# EAGLE schematic poseidon (EAGLE 9.2.2)

## Sheet 1 of 3
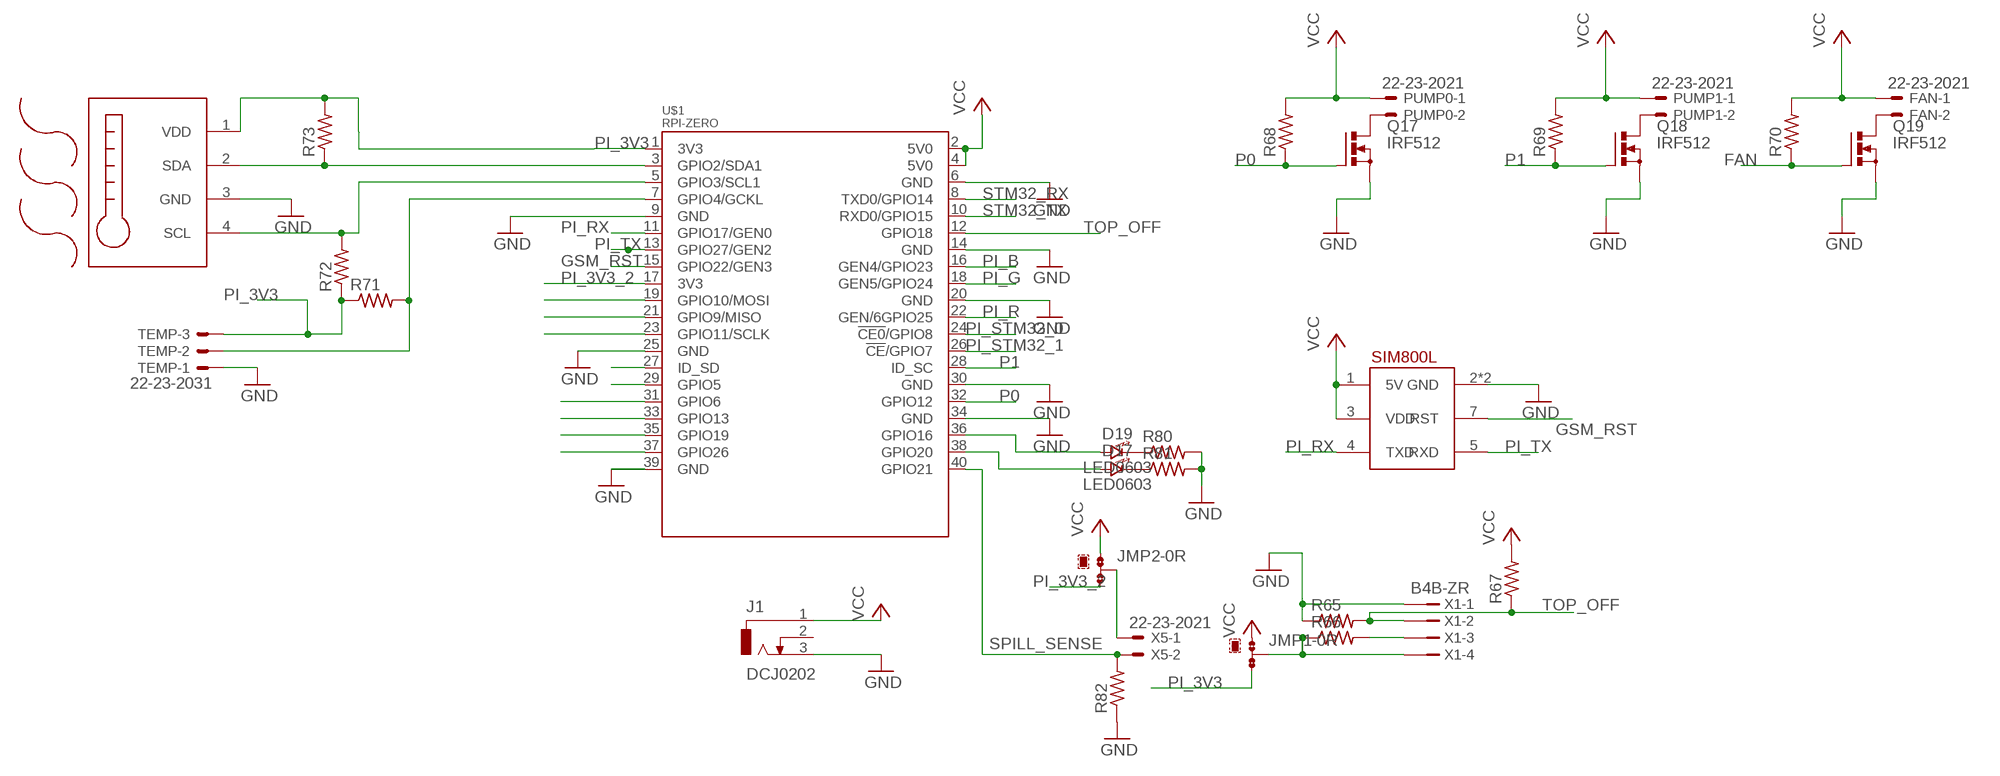
[diagram p0: schematic, sheet 1]

### Parts
D17  LED0603  [LED-0603]
D19  LED0603  [LED-0603]
FAN  22-23-2021  [22-23-2021]
J1  DCJ0202  [DCJ0202]
JMP1  0R-JUMPA  [A0R-JMP]
JMP2  0R-JUMPA  [A0R-JMP]
PUMP0  22-23-2021  [22-23-2021]
PUMP1  22-23-2021  [22-23-2021]
Q17  IRF512  [TO220BV]
Q18  IRF512  [TO220BV]
Q19  IRF512  [TO220BV]
R65  R-US_R0805  [R0805]
R66  R-US_R0805  [R0805]
R67  R-US_M0805  [M0805]
R68  R-US_R0805  [R0805]
R69  R-US_R0805  [R0805]
R70  R-US_R0805  [R0805]
R71  R-US_R0805  [R0805]
R72  R-US_R0805  [R0805]
R73  R-US_R0805  [R0805]
R80  R-US_R0805  [R0805]
R81  R-US_R0805  [R0805]
R82  R-US_R0805  [R0805]
TEMP  22-23-2031  [22-23-2031]
U$1  RPI-ZERO  [RASPBERRYPI_BASTELSTUBE_V13_RASPI_BOARD_B+_FULL]
U$3  AM2320  [4PIN_SMD]
U$21  SIM800L  [SIP]
X1  B4B-ZR  [B4B-ZR]
X5  22-23-2021  [22-23-2021]

### Nets
FAN: Q19.G R70.1 ; also sheet 3
GND: J1.3 Q17.S Q18.S Q19.S R65.1 R80.2 R81.2 R82.1 TEMP.1 U$1.6(GND) U$1.9(GND) U$1.14(GND) U$1.20(GND) U$1.25(GND) U$1.30(GND) U$1.34(GND) U$1.39(GND) U$3.3(GND) U$21.2(GND) U$21.6(GND) X1.1 ; also sheet 2,3
GSM_RST: U$1.15(GPIO22/GEN3) U$21.7(RST)
N$1: PUMP0.2 Q17.D
N$5: D19.C(CATHODE) R80.1
N$6: R66.2 X1.3
N$9: JMP1.2 R66.1 X1.4
N$10: PUMP1.2 Q18.D
N$13: D17.C(CATHODE) R81.1
N$14: FAN.2 Q19.D
N$17: R71.2 TEMP.2 U$1.7(GPIO4/GCKL)
N$18: R73.1 U$1.3(GPIO2/SDA1) U$3.2(SDA)
N$21: R72.2 U$1.5(GPIO3/SCL1) U$3.4(SCL)
N$26: D19.A(ANODE) U$1.36(GPIO16)
N$29: D17.A(ANODE) U$1.38(GPIO20)
N$30: JMP2.2 X5.1
N$33: U$1.19(GPIO10/MOSI)
N$37: U$1.21(GPIO9/MISO)
N$38: U$1.23(GPIO11/SCLK)
N$41: U$1.27(ID_SD)
N$42: U$1.29(GPIO5)
N$45: U$1.31(GPIO6)
N$46: U$1.33(GPIO13)
N$49: U$1.35(GPIO19)
N$50: U$1.37(GPIO26)
P0: Q17.G R68.1 U$1.32(GPIO12)
P1: Q18.G R69.1 U$1.28(ID_SC)
PI_3V3: JMP1.3 R71.1 R72.1 R73.2 TEMP.3 U$1.1(3V3) U$3.1(VDD) ; also sheet 3
PI_3V3_2: JMP2.3 U$1.17(3V3)
PI_B: U$1.16(GEN4/GPIO23) ; also sheet 3
PI_G: U$1.18(GEN5/GPIO24) ; also sheet 3
PI_R: U$1.22(GEN/6GPIO25) ; also sheet 3
PI_RX: U$1.11(GPIO17/GEN0) U$21.4(TXD)
PI_STM32_0: U$1.24(!CE0!/GPIO8) ; also sheet 3
PI_STM32_1: U$1.26(!CE!/GPIO7) ; also sheet 3
PI_TX: U$1.13(GPIO27/GEN2) U$21.5(RXD)
SPILL_SENSE: R82.2 U$1.40(GPIO21) X5.2
STM32_RX: U$1.8(TXD0/GPIO14) ; also sheet 3
STM32_TX: U$1.10(RXD0/GPIO15) ; also sheet 3
TOP_OFF: R65.2 R67.1 U$1.12(GPIO18) X1.2
VCC: FAN.1 J1.1 JMP1.1 JMP2.1 PUMP0.1 PUMP1.1 R67.2 R68.2 R69.2 R70.2 U$1.2(5V0) U$1.4(5V0) U$21.1(5V) U$21.3(VDD) ; also sheet 2,3
Unconnected: J1.2

## Sheet 2 of 3
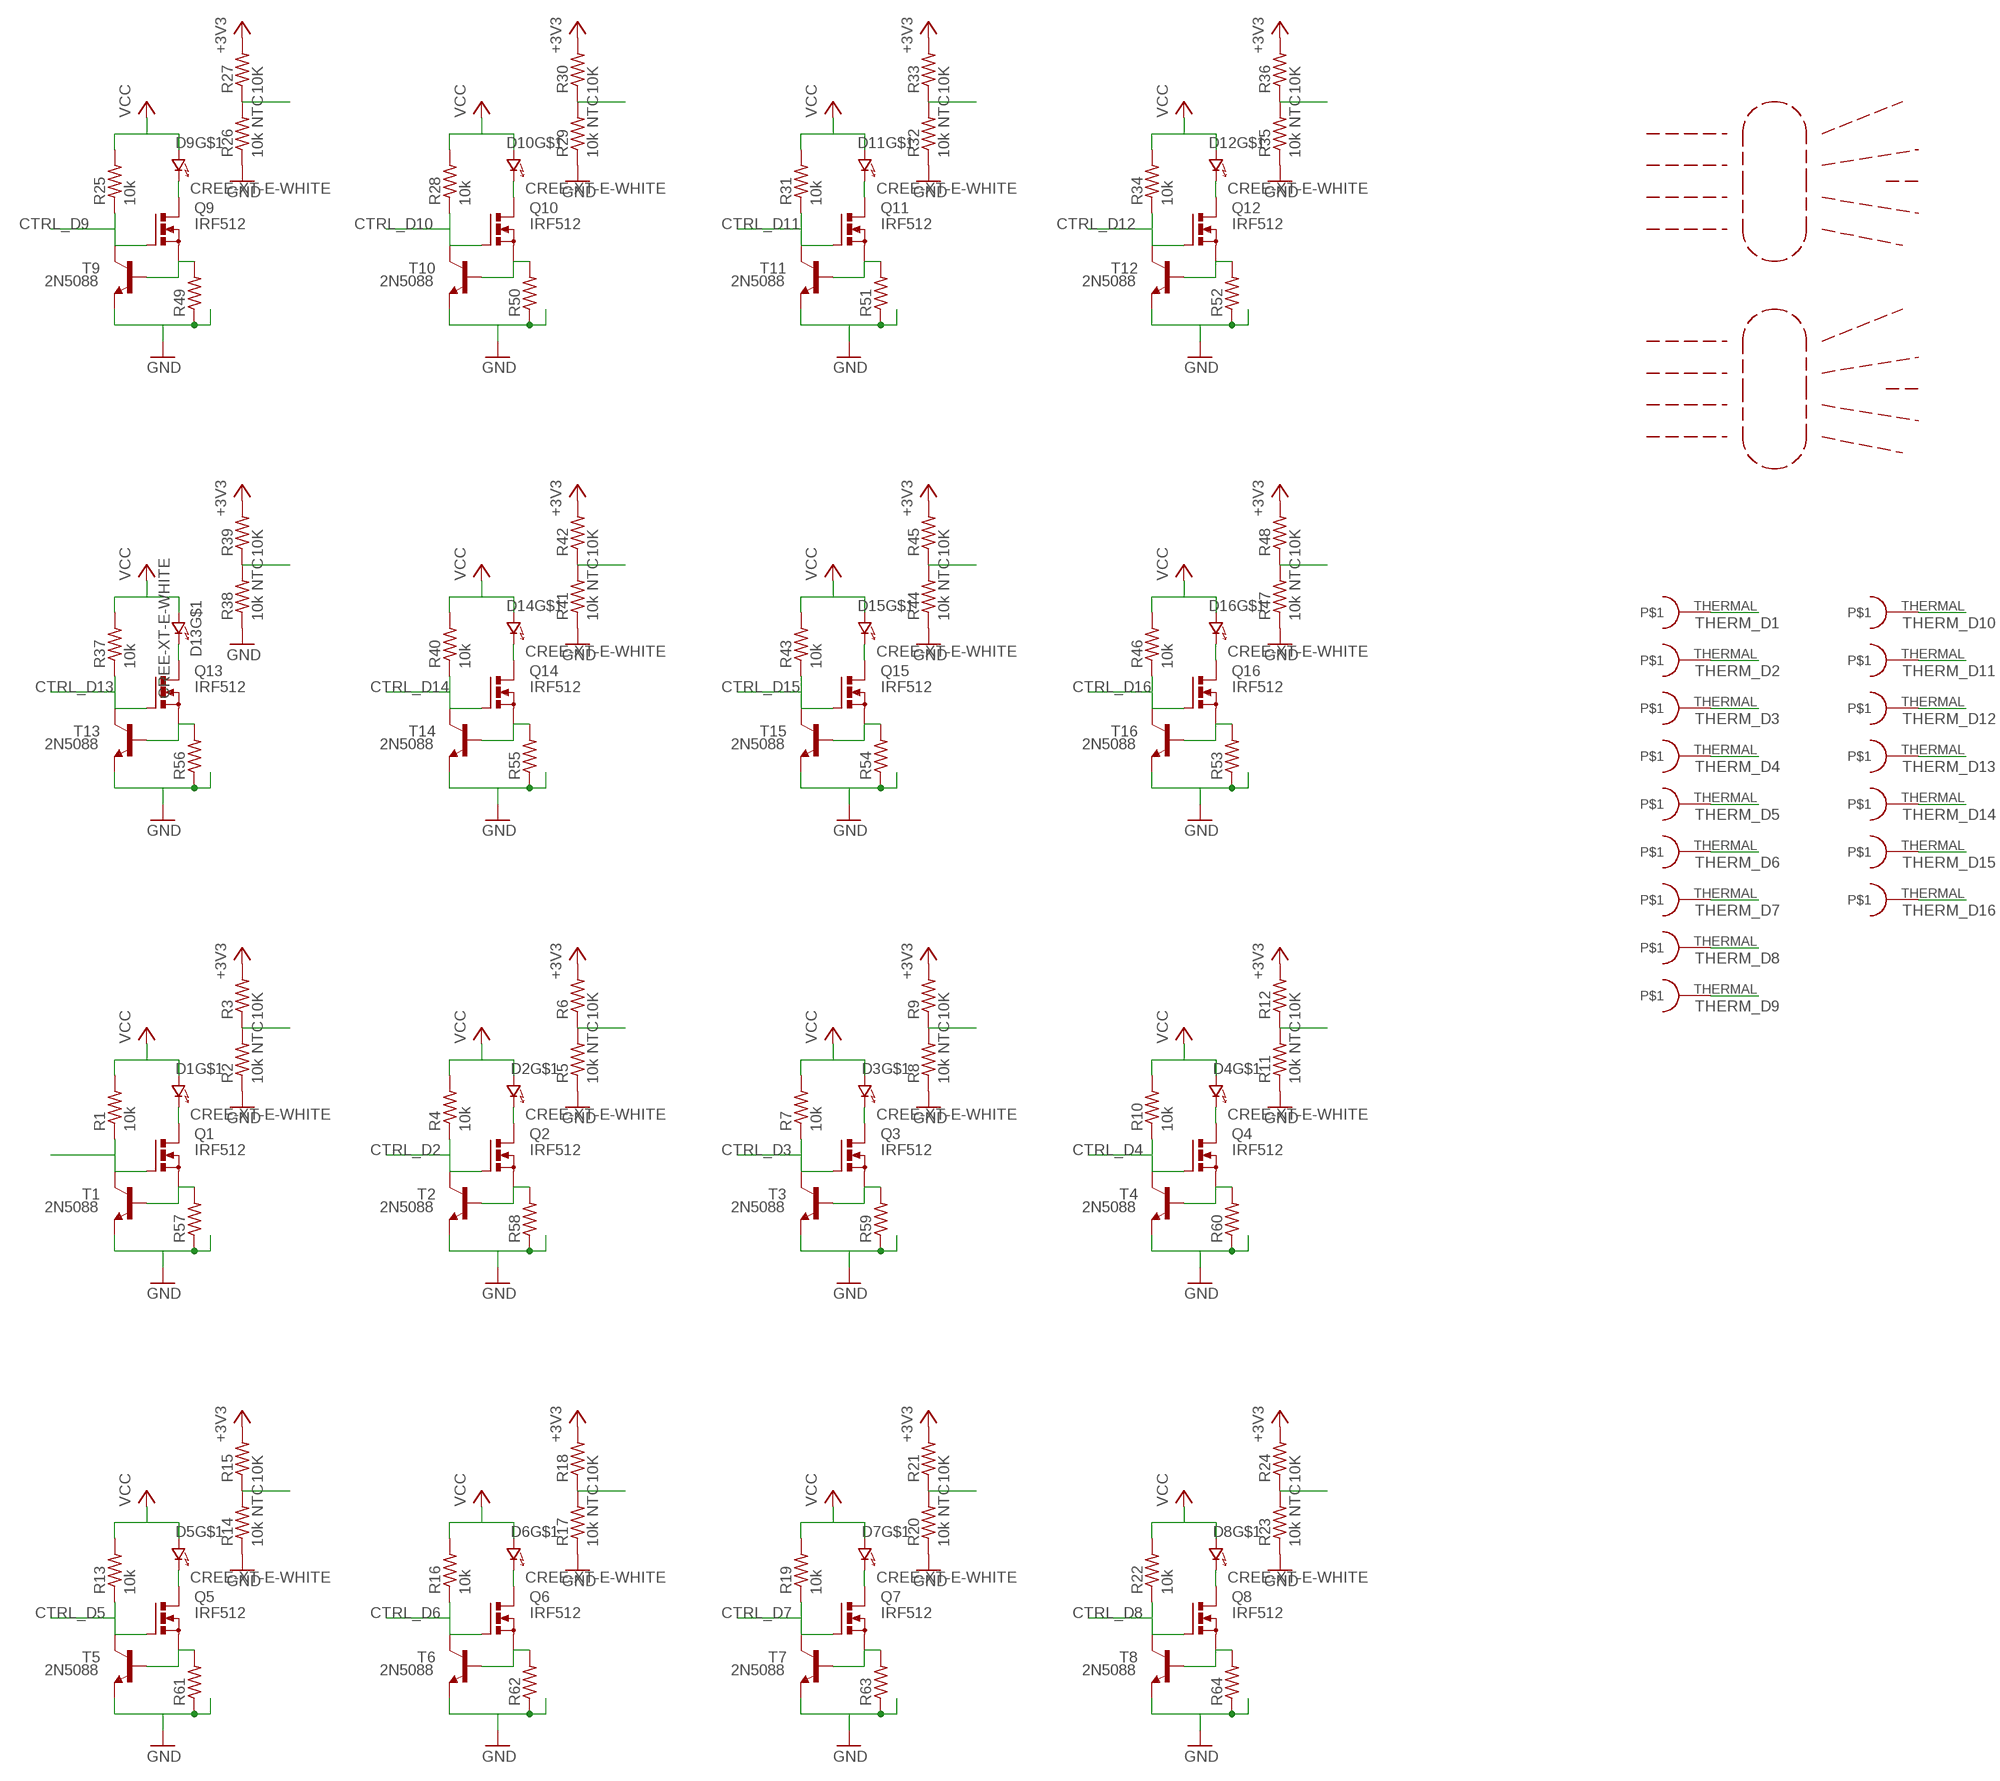
[diagram p1: schematic, sheet 2]

### Parts
D1  CREE-XT-E-WHITE  [CREE-XT-E]
D2  CREE-XT-E-WHITE  [CREE-XT-E]
D3  CREE-XT-E-WHITE  [CREE-XT-E]
D4  CREE-XT-E-WHITE  [CREE-XT-E]
D5  CREE-XT-E-WHITE  [CREE-XT-E]
D6  CREE-XT-E-WHITE  [CREE-XT-E]
D7  CREE-XT-E-WHITE  [CREE-XT-E]
D8  CREE-XT-E-WHITE  [CREE-XT-E]
D9  CREE-XT-E-WHITE  [CREE-XT-E]
D10  CREE-XT-E-WHITE  [CREE-XT-E]
D11  CREE-XT-E-WHITE  [CREE-XT-E]
D12  CREE-XT-E-WHITE  [CREE-XT-E]
D13  CREE-XT-E-WHITE  [CREE-XT-E]
D14  CREE-XT-E-WHITE  [CREE-XT-E]
D15  CREE-XT-E-WHITE  [CREE-XT-E]
D16  CREE-XT-E-WHITE  [CREE-XT-E]
Q1  IRF512  [TO220BV]
Q2  IRF512  [TO220BV]
Q3  IRF512  [TO220BV]
Q4  IRF512  [TO220BV]
Q5  IRF512  [TO220BV]
Q6  IRF512  [TO220BV]
Q7  IRF512  [TO220BV]
Q8  IRF512  [TO220BV]
Q9  IRF512  [TO220BV]
Q10  IRF512  [TO220BV]
Q11  IRF512  [TO220BV]
Q12  IRF512  [TO220BV]
Q13  IRF512  [TO220BV]
Q14  IRF512  [TO220BV]
Q15  IRF512  [TO220BV]
Q16  IRF512  [TO220BV]
R1  10k  R-US_R0805  [R0805]
R2  10k NTC  R-US_R0805  [R0805]
R3  10K  R-US_R0603  [R0603]
R4  10k  R-US_R0805  [R0805]
R5  10k NTC  R-US_R0805  [R0805]
R6  10K  R-US_R0603  [R0603]
R7  10k  R-US_R0805  [R0805]
R8  10k NTC  R-US_R0805  [R0805]
R9  10K  R-US_R0603  [R0603]
R10  10k  R-US_R0805  [R0805]
R11  10k NTC  R-US_R0805  [R0805]
R12  10K  R-US_R0603  [R0603]
R13  10k  R-US_R0805  [R0805]
R14  10k NTC  R-US_R0805  [R0805]
R15  10K  R-US_R0603  [R0603]
R16  10k  R-US_R0805  [R0805]
R17  10k NTC  R-US_R0805  [R0805]
R18  10K  R-US_R0603  [R0603]
R19  10k  R-US_R0805  [R0805]
R20  10k NTC  R-US_R0805  [R0805]
R21  10K  R-US_R0603  [R0603]
R22  10k  R-US_R0805  [R0805]
R23  10k NTC  R-US_R0805  [R0805]
R24  10K  R-US_R0603  [R0603]
R25  10k  R-US_R0805  [R0805]
R26  10k NTC  R-US_R0805  [R0805]
R27  10K  R-US_R0603  [R0603]
R28  10k  R-US_R0805  [R0805]
R29  10k NTC  R-US_R0805  [R0805]
R30  10K  R-US_R0603  [R0603]
R31  10k  R-US_R0805  [R0805]
R32  10k NTC  R-US_R0805  [R0805]
R33  10K  R-US_R0603  [R0603]
R34  10k  R-US_R0805  [R0805]
R35  10k NTC  R-US_R0805  [R0805]
R36  10K  R-US_R0603  [R0603]
R37  10k  R-US_R0805  [R0805]
R38  10k NTC  R-US_R0805  [R0805]
R39  10K  R-US_R0603  [R0603]
R40  10k  R-US_R0805  [R0805]
R41  10k NTC  R-US_R0805  [R0805]
R42  10K  R-US_R0603  [R0603]
R43  10k  R-US_R0805  [R0805]
R44  10k NTC  R-US_R0805  [R0805]
R45  10K  R-US_R0603  [R0603]
R46  10k  R-US_R0805  [R0805]
R47  10k NTC  R-US_R0805  [R0805]
R48  10K  R-US_R0603  [R0603]
R49  R-US_R2512  [R2512]
R50  R-US_R2512  [R2512]
R51  R-US_R2512  [R2512]
R52  R-US_R2512  [R2512]
R53  R-US_R2512  [R2512]
R54  R-US_R2512  [R2512]
R55  R-US_R2512  [R2512]
R56  R-US_R2512  [R2512]
R57  R-US_R2512  [R2512]
R58  R-US_R2512  [R2512]
R59  R-US_R2512  [R2512]
R60  R-US_R2512  [R2512]
R61  R-US_R2512  [R2512]
R62  R-US_R2512  [R2512]
R63  R-US_R2512  [R2512]
R64  R-US_R2512  [R2512]
T1  2N5088  [TO92]
T2  2N5088  [TO92]
T3  2N5088  [TO92]
T4  2N5088  [TO92]
T5  2N5088  [TO92]
T6  2N5088  [TO92]
T7  2N5088  [TO92]
T8  2N5088  [TO92]
T9  2N5088  [TO92]
T10  2N5088  [TO92]
T11  2N5088  [TO92]
T12  2N5088  [TO92]
T13  2N5088  [TO92]
T14  2N5088  [TO92]
T15  2N5088  [TO92]
T16  2N5088  [TO92]
U$19  8X_LED_OPTIC  [FOCUS_GRID]
U$20  8X_LED_OPTIC  [FOCUS_GRID]

### Nets
+3V3: R3.2 R6.2 R9.2 R12.2 R15.2 R18.2 R21.2 R24.2 R27.2 R30.2 R33.2 R36.2 R39.2 R42.2 R45.2 R48.2 ; also sheet 3
CTRL_D1: Q1.G R1.1 T1.1(C) ; also sheet 3
CTRL_D2: Q2.G R4.1 T2.1(C) ; also sheet 3
CTRL_D3: Q3.G R7.1 T3.1(C) ; also sheet 3
CTRL_D4: Q4.G R10.1 T4.1(C) ; also sheet 3
CTRL_D5: Q5.G R13.1 T5.1(C) ; also sheet 3
CTRL_D6: Q6.G R16.1 T6.1(C) ; also sheet 3
CTRL_D7: Q7.G R19.1 T7.1(C) ; also sheet 3
CTRL_D8: Q8.G R22.1 T8.1(C) ; also sheet 3
CTRL_D9: Q9.G R25.1 T9.1(C) ; also sheet 3
CTRL_D10: Q10.G R28.1 T10.1(C) ; also sheet 3
CTRL_D11: Q11.G R31.1 T11.1(C) ; also sheet 3
CTRL_D12: Q12.G R34.1 T12.1(C) ; also sheet 3
CTRL_D13: Q13.G R37.1 T13.1(C) ; also sheet 3
CTRL_D14: Q14.G R40.1 T14.1(C) ; also sheet 3
CTRL_D15: Q15.G R43.1 T15.1(C) ; also sheet 3
CTRL_D16: Q16.G R46.1 T16.1(C) ; also sheet 3
GND: R2.1 R5.1 R8.1 R11.1 R14.1 R17.1 R20.1 R23.1 R26.1 R29.1 R32.1 R35.1 R38.1 R41.1 R44.1 R47.1 R49.1 R50.1 R51.1 R52.1 R53.1 R54.1 R55.1 R56.1 R57.1 R58.1 R59.1 R60.1 R61.1 R62.1 R63.1 R64.1 T1.3(E) T2.3(E) T3.3(E) T4.3(E) T5.3(E) T6.3(E) T7.3(E) T8.3(E) T9.3(E) T10.3(E) T11.3(E) T12.3(E) T13.3(E) T14.3(E) T15.3(E) T16.3(E) ; also sheet 1,3
N$2: D1.K(CATHODE) Q1.D
N$4: Q1.S R57.2 T1.2(B)
N$7: D2.K(CATHODE) Q2.D
N$8: Q2.S R58.2 T2.2(B)
N$11: D3.K(CATHODE) Q3.D
N$12: Q3.S R59.2 T3.2(B)
N$15: D4.K(CATHODE) Q4.D
N$16: Q4.S R60.2 T4.2(B)
N$19: D5.K(CATHODE) Q5.D
N$20: Q5.S R61.2 T5.2(B)
N$23: D6.K(CATHODE) Q6.D
N$24: Q6.S R62.2 T6.2(B)
N$27: D7.K(CATHODE) Q7.D
N$28: Q7.S R63.2 T7.2(B)
N$31: D8.K(CATHODE) Q8.D
N$32: Q8.S R64.2 T8.2(B)
N$35: D9.K(CATHODE) Q9.D
N$36: Q9.S R49.2 T9.2(B)
N$39: D10.K(CATHODE) Q10.D
N$40: Q10.S R50.2 T10.2(B)
N$43: D11.K(CATHODE) Q11.D
N$44: Q11.S R51.2 T11.2(B)
N$47: D12.K(CATHODE) Q12.D
N$48: Q12.S R52.2 T12.2(B)
N$51: D13.K(CATHODE) Q13.D
N$52: Q13.S R56.2 T13.2(B)
N$55: D14.K(CATHODE) Q14.D
N$56: Q14.S R55.2 T14.2(B)
N$59: D15.K(CATHODE) Q15.D
N$60: Q15.S R54.2 T15.2(B)
N$63: D16.K(CATHODE) Q16.D
N$64: Q16.S R53.2 T16.2(B)
TEMP_D1: R41.2 R42.1 ; also sheet 3
TEMP_D2: R8.2 R9.1 ; also sheet 3
TEMP_D3: R14.2 R15.1 ; also sheet 3
TEMP_D4: R17.2 R18.1 ; also sheet 3
TEMP_D5: R44.2 R45.1 ; also sheet 3
TEMP_D6: R47.2 R48.1 ; also sheet 3
TEMP_D7: R11.2 R12.1 ; also sheet 3
TEMP_D8: R20.2 R21.1 ; also sheet 3
TEMP_D9: R32.2 R33.1 ; also sheet 3
TEMP_D10: R29.2 R30.1 ; also sheet 3
TEMP_D11: R26.2 R27.1 ; also sheet 3
TEMP_D12: R23.2 R24.1 ; also sheet 3
TEMP_D13: R5.2 R6.1 ; also sheet 3
TEMP_D14: R35.2 R36.1 ; also sheet 3
TEMP_D15: R38.2 R39.1 ; also sheet 3
TEMP_D16: R2.2 R3.1 ; also sheet 3
THERM_D1: D1.THERMAL
THERM_D2: D2.THERMAL
THERM_D3: D3.THERMAL
THERM_D4: D4.THERMAL
THERM_D5: D5.THERMAL
THERM_D6: D6.THERMAL
THERM_D7: D7.THERMAL
THERM_D8: D8.THERMAL
THERM_D9: D9.THERMAL
THERM_D10: D10.THERMAL
THERM_D11: D11.THERMAL
THERM_D12: D12.THERMAL
THERM_D13: D13.THERMAL
THERM_D14: D14.THERMAL
THERM_D15: D15.THERMAL
THERM_D16: D16.THERMAL
VCC: D1.A(ANODE) D2.A(ANODE) D3.A(ANODE) D4.A(ANODE) D5.A(ANODE) D6.A(ANODE) D7.A(ANODE) D8.A(ANODE) D9.A(ANODE) D10.A(ANODE) D11.A(ANODE) D12.A(ANODE) D13.A(ANODE) D14.A(ANODE) D15.A(ANODE) D16.A(ANODE) R1.2 R4.2 R7.2 R10.2 R13.2 R16.2 R19.2 R22.2 R25.2 R28.2 R31.2 R34.2 R37.2 R40.2 R43.2 R46.2 ; also sheet 1,3

## Sheet 3 of 3
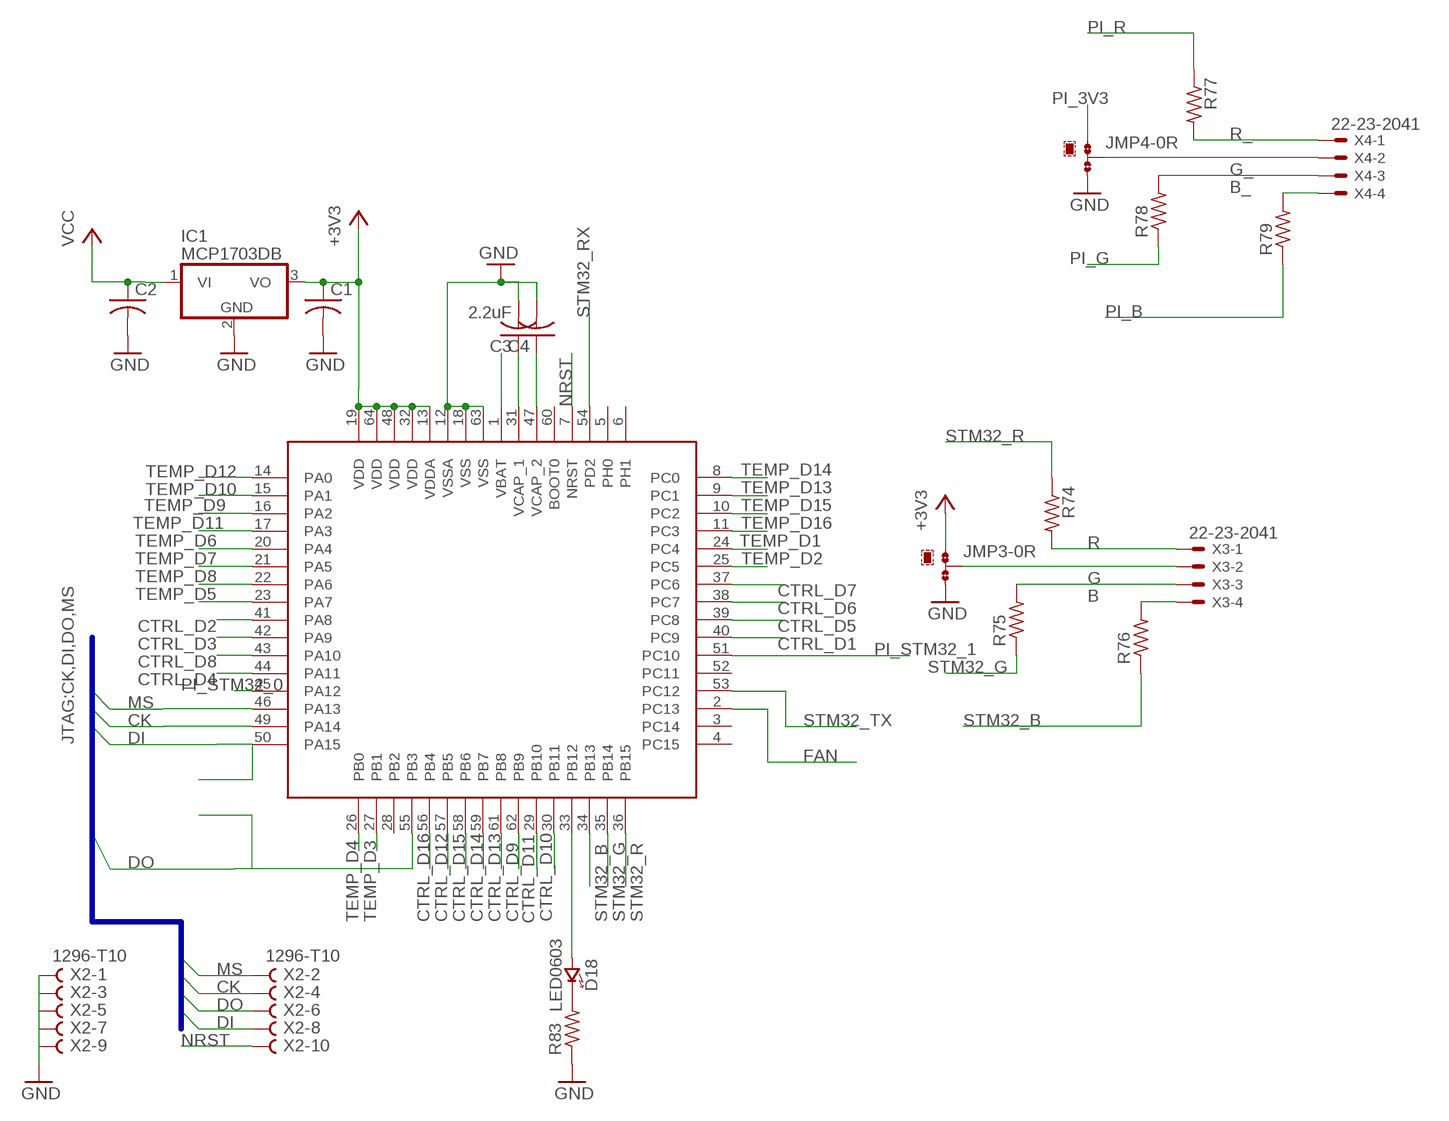
[diagram p2: schematic, sheet 3]

### Parts
C1  C-USC0805  [C0805]
C2  C-USC0805  [C0805]
C3  2.2uF  C-USC0402K  [C0402K]
C4  C-USC0402K  [C0402K]
D18  LED0603  [LED-0603]
IC1  MCP1703DB  [SOT223]
JMP3  0R-JUMPA  [A0R-JMP]
JMP4  0R-JUMPA  [A0R-JMP]
R74  R-US_R0805  [R0805]
R75  R-US_R0805  [R0805]
R76  R-US_R0805  [R0805]
R77  R-US_R0805  [R0805]
R78  R-US_R0805  [R0805]
R79  R-US_R0805  [R0805]
R83  R-US_R0805  [R0805]
U$2  STM32F41  [QFP50P1200X1200X160-64]
X2  1296-T10  [1296-10]
X3  22-23-2041  [22-23-2041]
X4  22-23-2041  [22-23-2041]

### Nets
+3V3: C1.1 IC1.3(VO) JMP3.1 U$2.13(VDDA) U$2.19(VDD) U$2.32(VDD) U$2.48(VDD) U$2.64(VDD) ; also sheet 2
B: R76.2 X3.4
B_: R79.2 X4.4
CK: U$2.49(PA14) X2.4
CTRL_D1: U$2.40(PC9) ; also sheet 2
CTRL_D2: U$2.41(PA8) ; also sheet 2
CTRL_D3: U$2.42(PA9) ; also sheet 2
CTRL_D4: U$2.44(PA11) ; also sheet 2
CTRL_D5: U$2.39(PC8) ; also sheet 2
CTRL_D6: U$2.38(PC7) ; also sheet 2
CTRL_D7: U$2.37(PC6) ; also sheet 2
CTRL_D8: U$2.43(PA10) ; also sheet 2
CTRL_D9: U$2.62(PB9) ; also sheet 2
CTRL_D10: U$2.30(PB11) ; also sheet 2
CTRL_D11: U$2.29(PB10) ; also sheet 2
CTRL_D12: U$2.57(PB5) ; also sheet 2
CTRL_D13: U$2.61(PB8) ; also sheet 2
CTRL_D14: U$2.59(PB7) ; also sheet 2
CTRL_D15: U$2.58(PB6) ; also sheet 2
CTRL_D16: U$2.56(PB4) ; also sheet 2
DI: U$2.50(PA15) X2.8
DO: U$2.55(PB3) X2.6
FAN: U$2.2(PC13) ; also sheet 1
G: R75.2 X3.3
G_: R78.2 X4.3
GND: C1.2 C2.2 C3.2 C4.2 IC1.2(GND) JMP3.3 JMP4.3 R83.1 U$2.12(VSSA) U$2.18(VSS) U$2.63(VSS) X2.1 X2.3 X2.5 X2.7 X2.9 ; also sheet 1,2
MS: U$2.46(PA13) X2.2
N$3: U$2.1(VBAT)
N$22: JMP4.2 X4.2
N$25: JMP3.2 X3.2
N$68: D18.C(CATHODE) R83.2
N$69: D18.A(ANODE) U$2.33(PB12)
N$70: C3.1 U$2.31(VCAP_1)
N$71: C4.1 U$2.47(VCAP_2)
NRST: U$2.7(NRST) X2.10
PI_3V3: JMP4.1 ; also sheet 1
PI_B: R79.1 ; also sheet 1
PI_G: R78.1 ; also sheet 1
PI_R: R77.1 ; also sheet 1
PI_STM32_0: U$2.45(PA12) ; also sheet 1
PI_STM32_1: U$2.51(PC10) ; also sheet 1
R: R74.2 X3.1
R_: R77.2 X4.1
STM32_B: R76.1 U$2.34(PB13)
STM32_G: R75.1 U$2.35(PB14)
STM32_R: R74.1 U$2.36(PB15)
STM32_RX: U$2.54(PD2) ; also sheet 1
STM32_TX: U$2.53(PC12) ; also sheet 1
TEMP_D1: U$2.24(PC4) ; also sheet 2
TEMP_D2: U$2.25(PC5) ; also sheet 2
TEMP_D3: U$2.27(PB1) ; also sheet 2
TEMP_D4: U$2.26(PB0) ; also sheet 2
TEMP_D5: U$2.23(PA7) ; also sheet 2
TEMP_D6: U$2.20(PA4) ; also sheet 2
TEMP_D7: U$2.21(PA5) ; also sheet 2
TEMP_D8: U$2.22(PA6) ; also sheet 2
TEMP_D9: U$2.16(PA2) ; also sheet 2
TEMP_D10: U$2.15(PA1) ; also sheet 2
TEMP_D11: U$2.17(PA3) ; also sheet 2
TEMP_D12: U$2.14(PA0) ; also sheet 2
TEMP_D13: U$2.9(PC1) ; also sheet 2
TEMP_D14: U$2.8(PC0) ; also sheet 2
TEMP_D15: U$2.10(PC2) ; also sheet 2
TEMP_D16: U$2.11(PC3) ; also sheet 2
VCC: C2.1 IC1.1(VI) ; also sheet 1,2
Unconnected: U$2.3(PC14) U$2.4(PC15) U$2.5(PH0) U$2.6(PH1) U$2.28(PB2) U$2.52(PC11) U$2.60(BOOT0)

### Buses
JTAG:CK,DI,DO,MS

## Library data of the parts
C1 C2 = rcl:C-US: CAPACITOR, American symbol; SPICEPREFIX: C
C3 C4 = resistor:C-US: CAPACITOR, American symbol
D1-D16 = leds:CREE-XT-E: Cree LED Lighting XLamp XT-E; DIGIKEY: XTEAWT-00-0000-000000G51CT-ND; MANUFACTURER: Cree; MPN: XTEAWT-00-0000-000000G51
D17-D19 = leds:LED: LED
FAN PUMP0 PUMP1 X5 = con-molex:22-23-2021: .100" (2.54mm) Center Header - 2 Pin; MF: MOLEX; MPN: 22-23-2021; OC_FARNELL: 1462926; OC_NEWARK: 25C3832
IC1 = linear:MCP1703: 250 mA, 16V, Low Quiescent Current LDO Regulator Source: http://ww1.microchip.com/downloads/en/DeviceDoc/22049b.pdf
J1 = con-jack:DCJ0202: DC POWER JACK Source: DCJ0202.pdf; OC_FARNELL: unknown; OC_NEWARK: unknown
JMP1-JMP4 = jump-0r-smd:0R-JUMP: SMD 0R 0805 Jumper
Q1-Q19 = transistor-power:IRF512: N-CHANNEL MOS FET
R1-R64 R71-R73 = rcl:R-US_: RESISTOR, American symbol; SPICEPREFIX: R
R65-R70 R74-R83 = resistor:R-US_: RESISTOR, American symbol
T1-T16 = transistor:2N5088: NPN TRANSISTOR
TEMP = con-molex:22-23-2031: .100" (2.54mm) Center Header - 3 Pin; MF: MOLEX; MPN: 22-23-2031; OC_FARNELL: 1462950; OC_NEWARK: 30C0862
U$1 = RPI-Zero:RPI-ZERO
U$2 = LQFP-64:STM32F41: 64 pin STM 32 F41
U$3 = cblocker:AM2320
U$19 U$20 = optic:8X_LED_OPTIC
U$21 = SIM800L:SIM800L: SIM800L Blue EVB Board with Level Translation and diode dropper.
X1 = con-jst:?4B-ZR: ZH CONNECTOR 1.5 mm, 4 pin 1 row Source: http://www.jst.com .. eZH.pdf; MF: FARNELL; MPN: B4B-ZR(LF)(SN); OC_FARNELL: 1830916; OC_NEWARK: 37K9960
X2 = con-leotronics:1296-T10: 1.27mm SINGLE ROW FEMALE SOCKET Source: http://www.leotronics.co.uk/Conexcon/Data%20Sheets/sec.%20A/1296ing.pdf; OC_FARNELL: unknown; OC_NEWARK: unknown
X3 X4 = con-molex:22-23-2041: .100" (2.54mm) Center Header - 4 Pin; MF: MOLEX; MPN: 22-23-2041; OC_FARNELL: 1462920; OC_NEWARK: 38C0355